# EAGLE schematic Deconstruction (EAGLE 6.4)
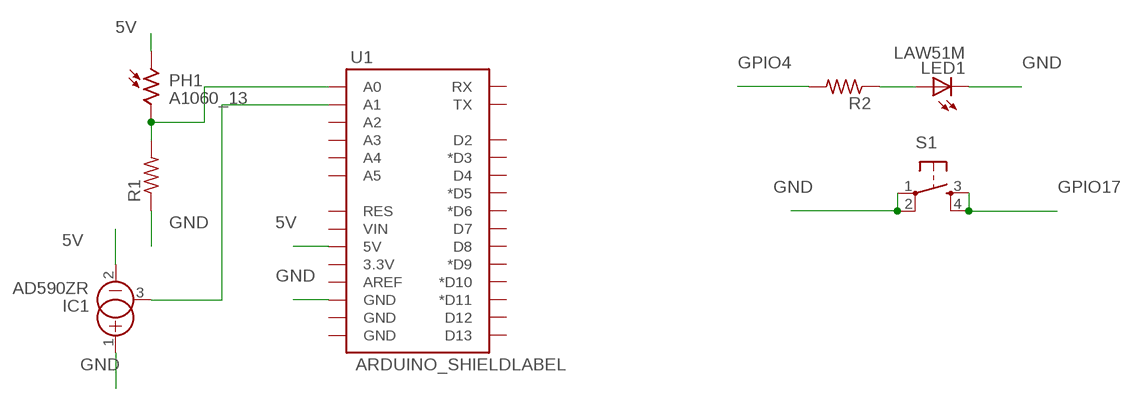
[diagram p0: schematic, sheet 1]

## Parts
IC1  AD590ZR  [TO92]
LED1  LAW51M  [W51]
PH1  A1060_13  [T0-46-A10XX]
R1  R-US_0411/12  [0411/12]
R2  R-US_0411/12  [0411/12]
S1  TAC_SWITCHPTH  [TACTILE-PTH]
U1  ARDUINO_SHIELDLABEL  [DUEMILANOVE_SHIELD]

## Nets
5V: IC1.2(-) PH1.1 U1.5V
GND: IC1.1(+) LED1.C R1.1 S1.1 S1.2 U1.GND@2(GND)
GPIO4: R2.2
GPIO17: S1.3 S1.4
N$2: LED1.A R2.1
N$10: IC1.3(CAN) U1.A1
N$11: PH1.2 R1.2 U1.A0
Unconnected: LED1.TH@1(TH) LED1.TH@2(TH) LED1.TH@3(TH) U1.3.3V U1.A2 U1.A3 U1.A4 U1.A5 U1.AREF U1.D2 U1.D3(*D3) U1.D4 U1.D5(*D5) U1.D6(*D6) U1.D7 U1.D8 U1.D9(*D9) U1.D10(*D10) U1.D11(*D11) U1.D12 U1.D13 U1.GND@0(GND) U1.GND@1(GND) U1.RES U1.RX U1.TX U1.VIN

## Library data of the parts
IC1 = linear:AD590ZR: TEMPERATURE SENSOR current output
LED1 = led:*W51M: Golden DRAGON® with Lens Enhanced Thinfilm LED Source: LA_LR_LY_W51M_Pb_free[1].pdf
PH1 = photo-elements:A10: Sensor Robust Light Sensing Applications Outdoor Light Sensing Application Source: http://optoelectronics.perkinelmer.com/content/Datasheets/DTS_PhotocellsA1050.pdf
R1 R2 = resistor:R-US_: RESISTOR, American symbol
S1 = SparkFun:TAC_SWITCH: Momentary Switch Button commonly used for reset or general input. Spark Fun Electronics SKU : COM-00097
U1 = SparkFun-Boards:ARDUINO_SHIELD: Arduino shield footprint